# Altium project 2012_BALISE_CARTE_EMETTEUR.PRJPCB
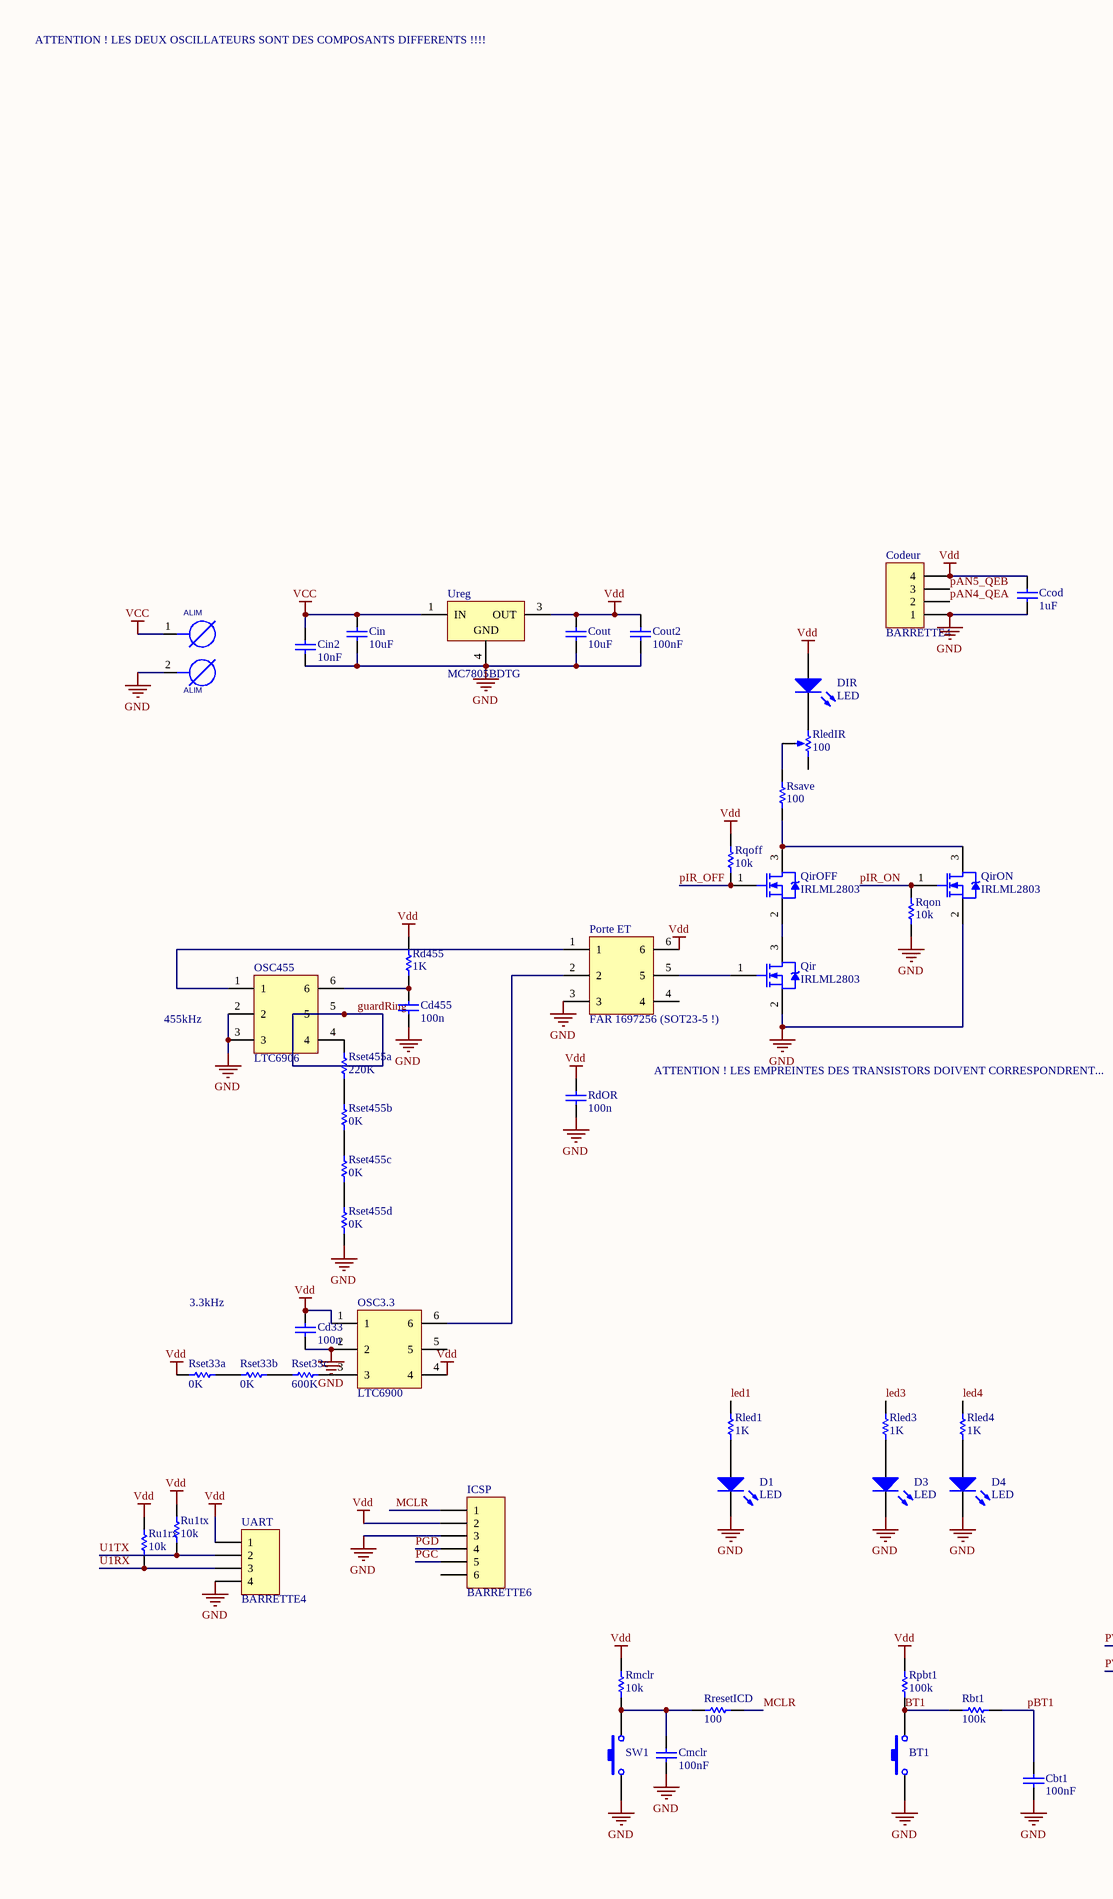
[diagram p0: 2012_BALISE_CARTE_EMETTEUR.SchDoc, left]
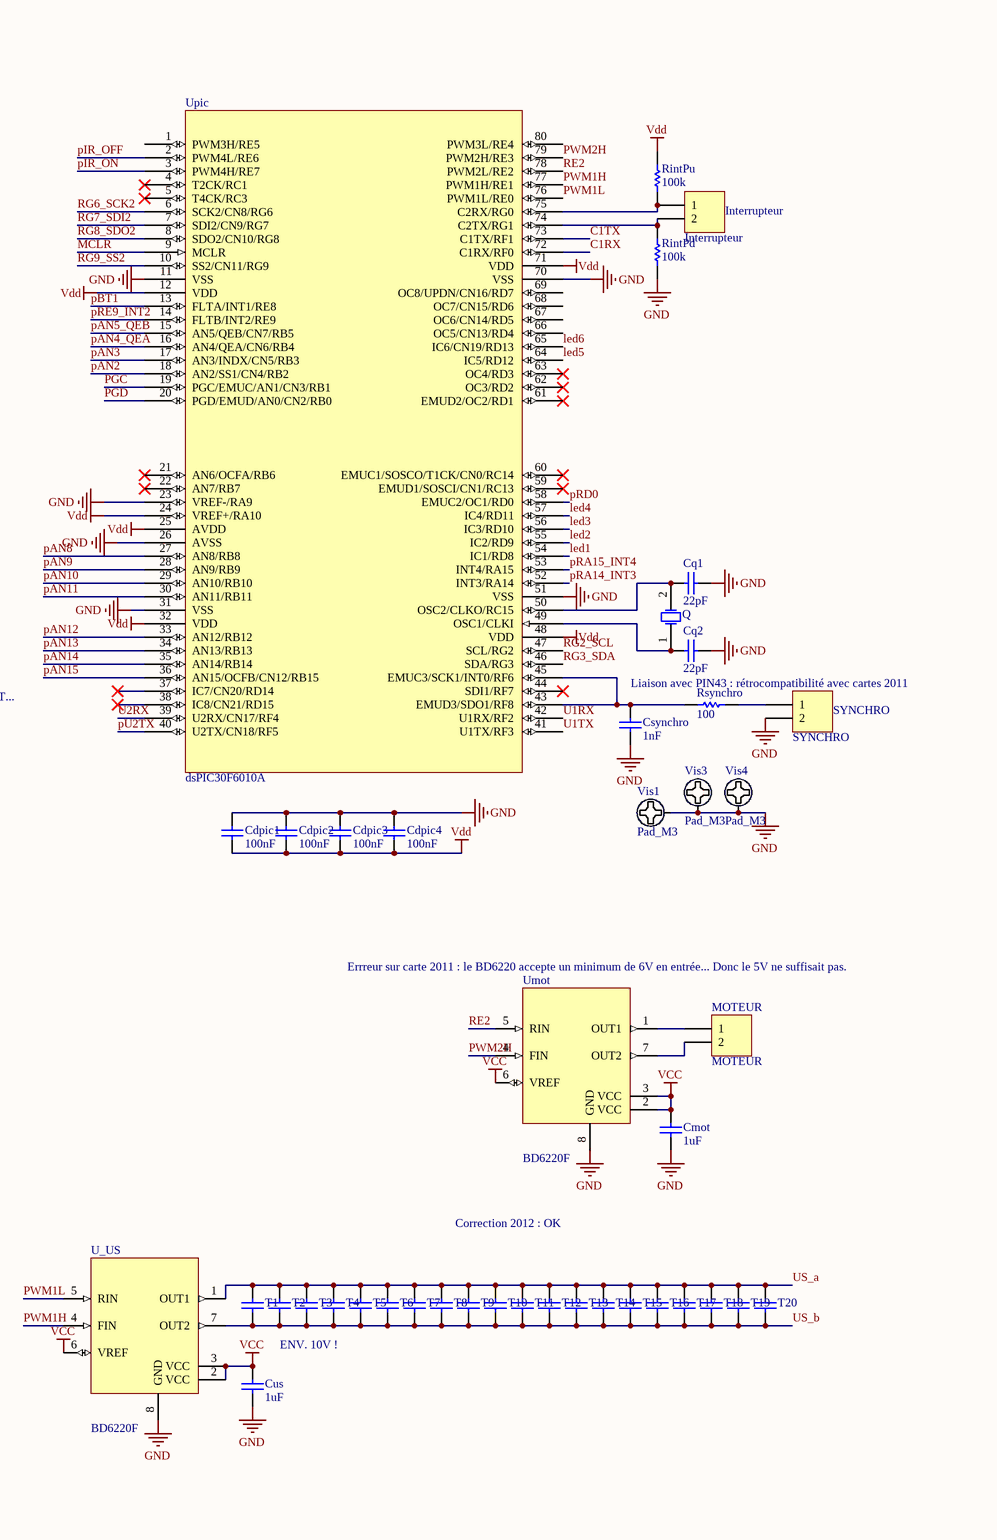
[diagram p1: 2012_BALISE_CARTE_EMETTEUR.SchDoc, middle]
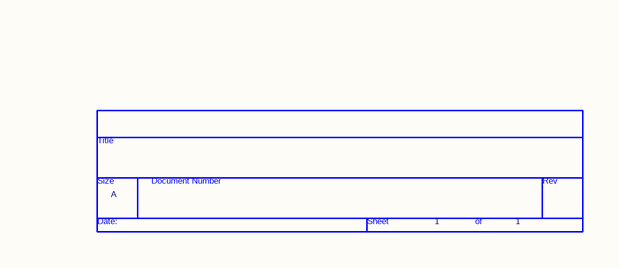
[diagram p2: 2012_BALISE_CARTE_EMETTEUR.SchDoc, right]
1 sheet, 91 parts. Net scope: global (net labels, ports and power ports of the same name join across sheets).
Board file: 2012_BALISE_CARTE_EMETTEUR.PCBDOC

## Sheet 2012_BALISE_CARTE_EMETTEUR.SchDoc
size A3

### Parts
*  Page Count: 1  Page Size: A  (hidden comment: TitleBlock0)  (graphical)
ALIM  ALIM  [BORNIER2]
BT1  SW_Pushbutton_6x6mm_Vertical  [Switch 6x6 Vertical]  (value not drawn)
Cbt1  100nF  [C0805_N]
Ccod  1uF  [C1206_N]
Cd33  100n  [C0805_N]
Cd455  100n  [C0805_N]
Cdpic1  100nF  [C0805_N]
Cdpic2  100nF  [C0805_N]
Cdpic3  100nF  [C0805_N]
Cdpic4  100nF  [C0805_N]
Cin  10uF  [C1206_N]
Cin2  10nF  [C0805_N]
Cmclr  100nF  [C0805_N]
Cmot  1uF  [C1206_N]
Codeur  BARRETTE4  [HE14_4]
Cout  10uF  [C1206_N]
Cout2  100nF  [C0805_N]
Cq1  22pF  [C0805_N]
Cq2  22pF  [C0805_N]
Csynchro  1nF  [C0805_N]
Cus  1uF  [C1206_N]
D1  LED  [LED_0805]
D3  LED  [LED_0805]
D4  LED  [LED_0805]
DIR  LED  [LED5]
ICSP  BARRETTE6  [HE14_6]
Interrupteur  Interrupteur  [HEADER2]
MOTEUR  MOTEUR  [HEADER2]
OSC3.3  LTC6900  [SOT23-6]
OSC455  LTC6906  [SOT23-6]
Porte_ET  FAR 1697256 (SOT23-5 !)  [SOT23-6]
Q  QU  [HC49US]  (value not drawn)
Qir  IRLML2803  [SOT-23]
QirOFF  IRLML2803  [SOT-23]
QirON  IRLML2803  [SOT-23]
Rbt1  100k  [R1206_N]
Rd455  1K  [R1206_N]
RdOR  100n  [C0805_N]
RintPd  100k  [R1206_N]
RintPu  100k  [R1206_N]
Rled1  1K  [R1206_N]
Rled3  1K  [R1206_N]
Rled4  1K  [R1206_N]
RledIR  100  [Trimmer_Bourns_3314G]
Rmclr  10k  [R1206_N]
Rpbt1  100k  [R1206_N]
Rqoff  10k  [R1206_N]
Rqon  10k  [R1206_N]
RresetICD  100  [R1206_N]
Rsave  100  [R1206_N]
Rset33a  0K  [R1206_N]
Rset33b  0K  [R1206_N]
Rset33c  600K  [R1206_N]
Rset455a  220K  [R1206_N]
Rset455b  0K  [R1206_N]
Rset455c  0K  [R1206_N]
Rset455d  0K  [R1206_N]
Rsynchro  100  [R1206_N]
Ru1rx  10k  [R1206_N]
Ru1tx  10k  [R1206_N]
SW1  SW_Pushbutton_6x6mm_Vertical  [Switch 6x6 Vertical]  (value not drawn)
SYNCHRO  SYNCHRO  [HEADER2]
T1  40kHz  [MA40S4R/S Transducteur US - 3D haut de carte]  (value not drawn)
T2  40kHz  [MA40S4R/S Transducteur US - 3D haut de carte]  (value not drawn)
T3  40kHz  [MA40S4R/S Transducteur US - 3D haut de carte]  (value not drawn)
T4  40kHz  [MA40S4R/S Transducteur US - 3D haut de carte]  (value not drawn)
T5  40kHz  [MA40S4R/S Transducteur US - 3D haut de carte]  (value not drawn)
T6  40kHz  [MA40S4R/S Transducteur US - 3D haut de carte]  (value not drawn)
T7  40kHz  [MA40S4R/S Transducteur US - 3D haut de carte]  (value not drawn)
T8  40kHz  [MA40S4R/S Transducteur US - 3D haut de carte]  (value not drawn)
T9  40kHz  [MA40S4R/S Transducteur US - 3D haut de carte]  (value not drawn)
T10  40kHz  [MA40S4R/S Transducteur US - 3D haut de carte]  (value not drawn)
T11  40kHz  [MA40S4R/S Transducteur US - 3D haut de carte]  (value not drawn)
T12  40kHz  [MA40S4R/S Transducteur US - 3D haut de carte]  (value not drawn)
T13  40kHz  [MA40S4R/S Transducteur US - 3D haut de carte]  (value not drawn)
T14  40kHz  [MA40S4R/S Transducteur US - 3D haut de carte]  (value not drawn)
T15  40kHz  [MA40S4R/S Transducteur US - 3D haut de carte]  (value not drawn)
T16  40kHz  [MA40S4R/S Transducteur US - 3D haut de carte]  (value not drawn)
T17  40kHz  [MA40S4R/S Transducteur US - 3D haut de carte]  (value not drawn)
T18  40kHz  [MA40S4R/S Transducteur US - 3D haut de carte]  (value not drawn)
T19  40kHz  [MA40S4R/S Transducteur US - 3D haut de carte]  (value not drawn)
T20  40kHz  [MA40S4R/S Transducteur US - 3D haut de carte]  (value not drawn)
U_US  BD6220F  [SO8_N]
UART  BARRETTE4  [HE14_4]
Umot  BD6220F  [SO8_N]
Upic  dsPIC30F6010A  [TQFP80_N]
Ureg  MC7805BDTG  [369A-13]
Vis1  Pad_M3  [M3x6mm]
Vis3  Pad_M3  [M3x6mm]
Vis4  Pad_M3  [M3x6mm]

### Nets
GND: ALIM.2(B2) BT1.1 Cbt1.1 Ccod.1 Cd33.1 Cd455.1 Cdpic1.2 Cdpic2.2 Cdpic3.2 Cdpic4.2 Cin.1 Cin2.1 Cmclr.1 Cmot.1 Codeur.1 Cout.1 Cout2.1 Cq1.2 Cq2.2 Csynchro.1 Cus.1 D1.2 D3.2 D4.2 ICSP.3 OSC3.3.2 OSC455.2 OSC455.3 Porte_ET.3 Qir.2(S) QirON.2(S) RdOR.1 RintPd.2 Rqon.1 Rset455d.1 SW1.1 SYNCHRO.2 U_US.8(GND) UART.4 Umot.8(GND) Upic.11(VSS) Upic.23(VREF-/RA9) Upic.26(AVSS) Upic.31(VSS) Upic.51(VSS) Upic.70(VSS) Ureg.4(GND) Vis1.1 Vis3.1 Vis4.1
VCC: ALIM.1(B1) Cin.2 Cin2.2 Cmot.2 Cus.2 U_US.2(VCC) U_US.3(VCC) U_US.6(VREF) Umot.2(VCC) Umot.3(VCC) Umot.6(VREF) Ureg.1(IN)
Vdd: Ccod.2 Cd33.2 Cdpic1.1 Cdpic2.1 Cdpic3.1 Cdpic4.1 Codeur.4 Cout.2 Cout2.2 DIR.1 ICSP.2 OSC3.3.1 OSC3.3.4 Porte_ET.6 Rd455.2 RdOR.2 RintPu.1 Rmclr.2 Rpbt1.2 Rqoff.2 Rset33a.2 Ru1rx.2 Ru1tx.2 UART.1 Upic.12(VDD) Upic.24(VREF+/RA10) Upic.25(AVDD) Upic.32(VDD) Upic.48(VDD) Upic.71(VDD) Ureg.3(OUT)
BT1: BT1.3 Rbt1.2 Rpbt1.1
C1RX: Upic.72(C1RX/RF0)
C1TX: Upic.73(C1TX/RF1)
guardRing: OSC455.5
led1: Rled1.2 Upic.54(IC1/RD8)
led2: Upic.55(IC2/RD9)
led3: Rled3.2 Upic.56(IC3/RD10)
led4: Rled4.2 Upic.57(IC4/RD11)
led5: Upic.64(IC5/RD12)
led6: Upic.65(IC6/CN19/RD13)
MCLR: ICSP.1 RresetICD.1 Upic.9(MCLR)
pAN2: Upic.18(AN2/SS1/CN4/RB2)
pAN3: Upic.17(AN3/INDX/CN5/RB3)
pAN4_QEA: Codeur.2 Upic.16(AN4/QEA/CN6/RB4)
pAN5_QEB: Codeur.3 Upic.15(AN5/QEB/CN7/RB5)
pAN8: Upic.27(AN8/RB8)
pAN9: Upic.28(AN9/RB9)
pAN10: Upic.29(AN10/RB10)
pAN11: Upic.30(AN11/RB11)
pAN12: Upic.33(AN12/RB12)
pAN13: Upic.34(AN13/RB13)
pAN14: Upic.35(AN14/RB14)
pAN15: Upic.36(AN15/OCFB/CN12/RB15)
pBT1: Cbt1.2 Rbt1.1 Upic.13(FLTA/INT1/RE8)
PGC: ICSP.5 Upic.19(PGC/EMUC/AN1/CN3/RB1)
PGD: ICSP.4 Upic.20(PGD/EMUD/AN0/CN2/RB0)
pIR_OFF: QirOFF.1(G) Rqoff.1 Upic.2(PWM4L/RE6)
pIR_ON: QirON.1(G) Rqon.2 Upic.3(PWM4H/RE7)
pRA14_INT3: Upic.52(INT3/RA14)
pRA15_INT4: Upic.53(INT4/RA15)
pRD0: Upic.58(EMUC2/OC1/RD0)
pRE9_INT2: Upic.14(FLTB/INT2/RE9)
pU2TX: Upic.40(U2TX/CN18/RF5)
PWM1H: U_US.4(FIN) Upic.77(PWM1H/RE1)
PWM1L: U_US.5(RIN) Upic.76(PWM1L/RE0)
PWM2H: Umot.4(FIN) Upic.79(PWM2H/RE3)
RE2: Umot.5(RIN) Upic.78(PWM2L/RE2)
RG2_SCL: Upic.47(SCL/RG2)
RG3_SDA: Upic.46(SDA/RG3)
RG6_SCK2: Upic.6(SCK2/CN8/RG6)
RG7_SDI2: Upic.7(SDI2/CN9/RG7)
RG8_SDO2: Upic.8(SDO2/CN10/RG8)
RG9_SS2: Upic.10(SS2/CN11/RG9)
U1RX: Ru1rx.1 UART.3 Upic.42(U1RX/RF2)
U1TX: Ru1tx.1 UART.2 Upic.41(U1TX/RF3)
U2RX: Upic.39(U2RX/CN17/RF4)
US_a: T1.2 T2.2 T3.2 T4.2 T5.2 T6.2 T7.2 T8.2 T9.2 T10.2 T11.2 T12.2 T13.2 T14.2 T15.2 T16.2 T17.2 T18.2 T19.2 T20.2 U_US.1(OUT1)
US_b: T1.1 T2.1 T3.1 T4.1 T5.1 T6.1 T7.1 T8.1 T9.1 T10.1 T11.1 T12.1 T13.1 T14.1 T15.1 T16.1 T17.1 T18.1 T19.1 T20.1 U_US.7(OUT2)
NetCd455_2: Cd455.2 OSC455.6 Rd455.1
NetCmclr_2: Cmclr.2 Rmclr.1 RresetICD.2 SW1.3
NetCq1_1: Cq1.1 Q.2(OSC2) Upic.50(OSC2/CLKO/RC15)
NetCq2_1: Cq2.1 Q.1(OSC1) Upic.49(OSC1/CLKI)
NetCsynchro_2: Csynchro.2 Rsynchro.2 Upic.43(EMUD3/SDO1/RF8) Upic.45(EMUC3/SCK1/INT0/RF6)
NetD1_1: D1.1 Rled1.1
NetD3_1: D3.1 Rled3.1
NetD4_1: D4.1 Rled4.1
NetDIR_2: DIR.2 RledIR.1(TOP)
NetInterrupteur_1: Interrupteur.1 RintPu.2 Upic.75(C2RX/RG0)
NetInterrupteur_2: Interrupteur.2 RintPd.1 Upic.74(C2TX/RG1)
NetMOTEUR_1: MOTEUR.1 Umot.1(OUT1)
NetMOTEUR_2: MOTEUR.2 Umot.7(OUT2)
NetOSC3.3_3: OSC3.3.3 Rset33c.1
NetOSC3.3_6: OSC3.3.6 Porte_ET.2
NetOSC455_1: OSC455.1 Porte_ET.1
NetOSC455_4: OSC455.4 Rset455a.2
NetPorte_ET_5: Porte_ET.5 Qir.1(G)
NetQir_3: Qir.3(D) QirOFF.2(S)
NetQirOFF_3: QirOFF.3(D) QirON.3(D) Rsave.1
NetRledIR_2: RledIR.2(TAP) Rsave.2
NetRset33a_1: Rset33a.1 Rset33b.2
NetRset33b_1: Rset33b.1 Rset33c.2
NetRset455a_1: Rset455a.1 Rset455b.2
NetRset455b_1: Rset455b.1 Rset455c.2
NetRset455c_1: Rset455c.1 Rset455d.2
NetRsynchro_1: Rsynchro.1 SYNCHRO.1

Not connected (* = marked no-connect by the designer): ICSP 6; OSC3.3 5; Porte_ET 4; RledIR 3(BOT); Upic 1(PWM3H/RE5) 4(T2CK/RC1)* 5(T4CK/RC3)* 21(AN6/OCFA/RB6)* 22(AN7/RB7)* 37(IC7/CN20/RD14)* 38(IC8/CN21/RD15)* 44(SDI1/RF7)* 59(EMUD1/SOSCI/CN1/RC13)* 60(EMUC1/SOSCO/T1CK/CN0/RC14)* 61(EMUD2/OC2/RD1)* 62(OC3/RD2)* 63(OC4/RD3)* 66(OC5/CN13/RD4) 67(OC6/CN14/RD5) 68(OC7/CN15/RD6) 69(OC8/UPDN/CN16/RD7) 80(PWM3L/RE4)

### Notes on the sheet
- ATTENTION ! LES DEUX OSCILLATEURS SONT DES COMPOSANTS DIFFERENTS !!!!
- 455kHz
- ATTENTION ! LES EMPREINTES DES TRANSISTORS DOIVENT CORRESPONDRENT...
- Liaison avec PIN43 : rétrocompatibilité avec cartes 2011
- 3.3kHz
- Errreur sur carte 2011 : le BD6220 accepte un minimum de 6V en entrée... Donc le 5V ne suffisait pas.
- Correction 2012 : OK
- ENV. 10V !
- Title
- Size:
- Date:
- A3
- Number:
- Time:
- Revision:
- Sheet
- of
- File:
- (in symbol TitleBlock0) Title; Size; Document Number; Rev; Date:; Sheet; of

### Library data of the parts
ALIM = BORNIER2
BT1 SW1 = SW_Pushbutton_6x6mm_Vertical: Switch tactil 6mm x 6mm Vertical; Published: 27/11/09; PackageReference: 6mm X 6mm; Publisher: Damien Guitton
Cbt1 Cdpic1-Cdpic4 Cin Cin2 Cmclr Cout Cout2 Cq1 Cq2 Csynchro = Capacitor: Published: 8-Jun-2000; LatestRevisionDate: 17-Jul-2002; LatestRevisionNote: Re-released for DXP Platform.; PackageReference: RAD-0.3; Publisher: Altium Limited
Ccod Cd33 Cd455 Cmot Cus RdOR T1-T20 = Condensateur: Capacitor; Published: 8-Jun-2000; LatestRevisionDate: 17-Jul-2002; LatestRevisionNote: Re-released for DXP Platform.; PackageReference: RAD-0.3; Publisher: Altium Limited
Codeur UART = BARRETTE4: Header, 4-Pin; LatestRevisionDate: 17-Jul-2002; LatestRevisionNote: Re-released for DXP Platform.; Publisher: Altium Limited
D1 D3 D4 = LED: Typical LED; Published: 8-Jun-2000; LatestRevisionDate: 08-Jul-2005; LatestRevisionNote: Mech Layer 1 removed.; PackageReference: LED-1; Publisher: Altium Limited
DIR = LED: Typical RED, GREEN, YELLOW, AMBER GaAs LED; Published: 8-Jun-2000; LatestRevisionDate: 17-Jul-2002; LatestRevisionNote: Re-released for DXP Platform.; PackageDocument: Feb-2002; PackageReference: 3.2X1.6X1.1; Publisher: Altium Limited
ICSP = BARRETTE6: Header, 6-Pin; LatestRevisionDate: 17-Jul-2002; LatestRevisionNote: Re-released for DXP Platform.; Publisher: Altium Limited
Interrupteur MOTEUR SYNCHRO = BARRETTE2: Header, 2-Pin; LatestRevisionDate: 17-Jul-2002; LatestRevisionNote: Re-released for DXP Platform.; Publisher: Altium Limited
OSC3.3 OSC455 Porte_ET = SOT23-6: Header, 3-Pin, Dual row; LatestRevisionDate: 17-Jul-2002; LatestRevisionNote: Re-released for DXP Platform.; Publisher: Altium Limited
Q = QUARTZ_DROIT_BAS_PROFIL: Crystal Oscillator; FAR: 1666999; FAR: test; Published: 8-Jun-2000; LatestRevisionDate: 17-Jul-2002; LatestRevisionNote: Re-released for DXP Platform.; PackageReference: R38; Publisher: Altium Limited; Type: DROIT_BAS_PROFIL
Qir QirOFF QirON = IRLML2803: HEXFET Power MOSFET; Published: 8-Jun-2000; LatestRevisionDate: 17-Jul-2002; LatestRevisionNote: Re-released for DXP Platform.; DatasheetVersion: Aug-1997; PackageReference: SOT-23; Publisher: Altium Limited; PackageDescription: SOT-23; 3 Leads; Body 3.1 x 2.5 mm, inc. leads (LxW max); ComponentLink1Description: Manufacturer Link; ComponentLink1URL: http://www.irf.com/; ComponentLink2Description: Datasheet; ComponentLink2URL: http://www.irf.com/product-info/datasheets/data/irlml2803.pdf
Rbt1 Rd455 RintPd RintPu Rled1 Rled3 Rled4 Rmclr Rpbt1 Rqoff Rqon RresetICD Rsave Rset33a Rset33b Rset33c Rset455a Rset455b Rset455c Rset455d Rsynchro Ru1rx Ru1tx = Resistor: Published: 8-Jun-2000; LatestRevisionDate: 17-Jul-2002; LatestRevisionNote: Re-released for DXP Platform.; PackageReference: AXIAL-0.5; Publisher: Altium Limited
RledIR = Trimmer monotour, Bourns,serie 3314P
U_US Umot = BD6220F: H Bridge - 2A
Upic = dsPIC30F6010A: High-Performance, 16-bit Digital Signal Controllers
Ureg = MC7805ACD2T: Three-Terminal Positive Voltage Regulator; Note: Pin 2 is electrically connected to Pin 4; Pin 2 is trimmed and not drawn;; Published: 15-Apr-2002; DatasheetVersion: 1997; PackageVersion: 1997; PackageReference: 936-03; Publisher: Altium Limited; PackageDescription: D2-PAK/TO-263-AB; 3 Leads (1 Cropped); Body 14.7 (inc. leads) x 10.2 mm (LxW max); ComponentLink1Description: Manufacturer Link; ComponentLink1URL: http://www.onsemi.com/site/products/taxonomy/0,4438,503,00.html; ComponentLink2Description: Datasheet; ComponentLink2URL: http://www.onsemi.com/pub/Collateral/MC7800-D.PDF
Vis1 Vis3 Vis4 = Vis M3 X 6mm _TORX_Tête 6mm: Publisher: Damien Guitton
* = TitleBlock0: Page Number: 1; Page Create Date: March  8, 1995